# EAGLE design ft232-modul_v1.0 (EAGLE 4.14)
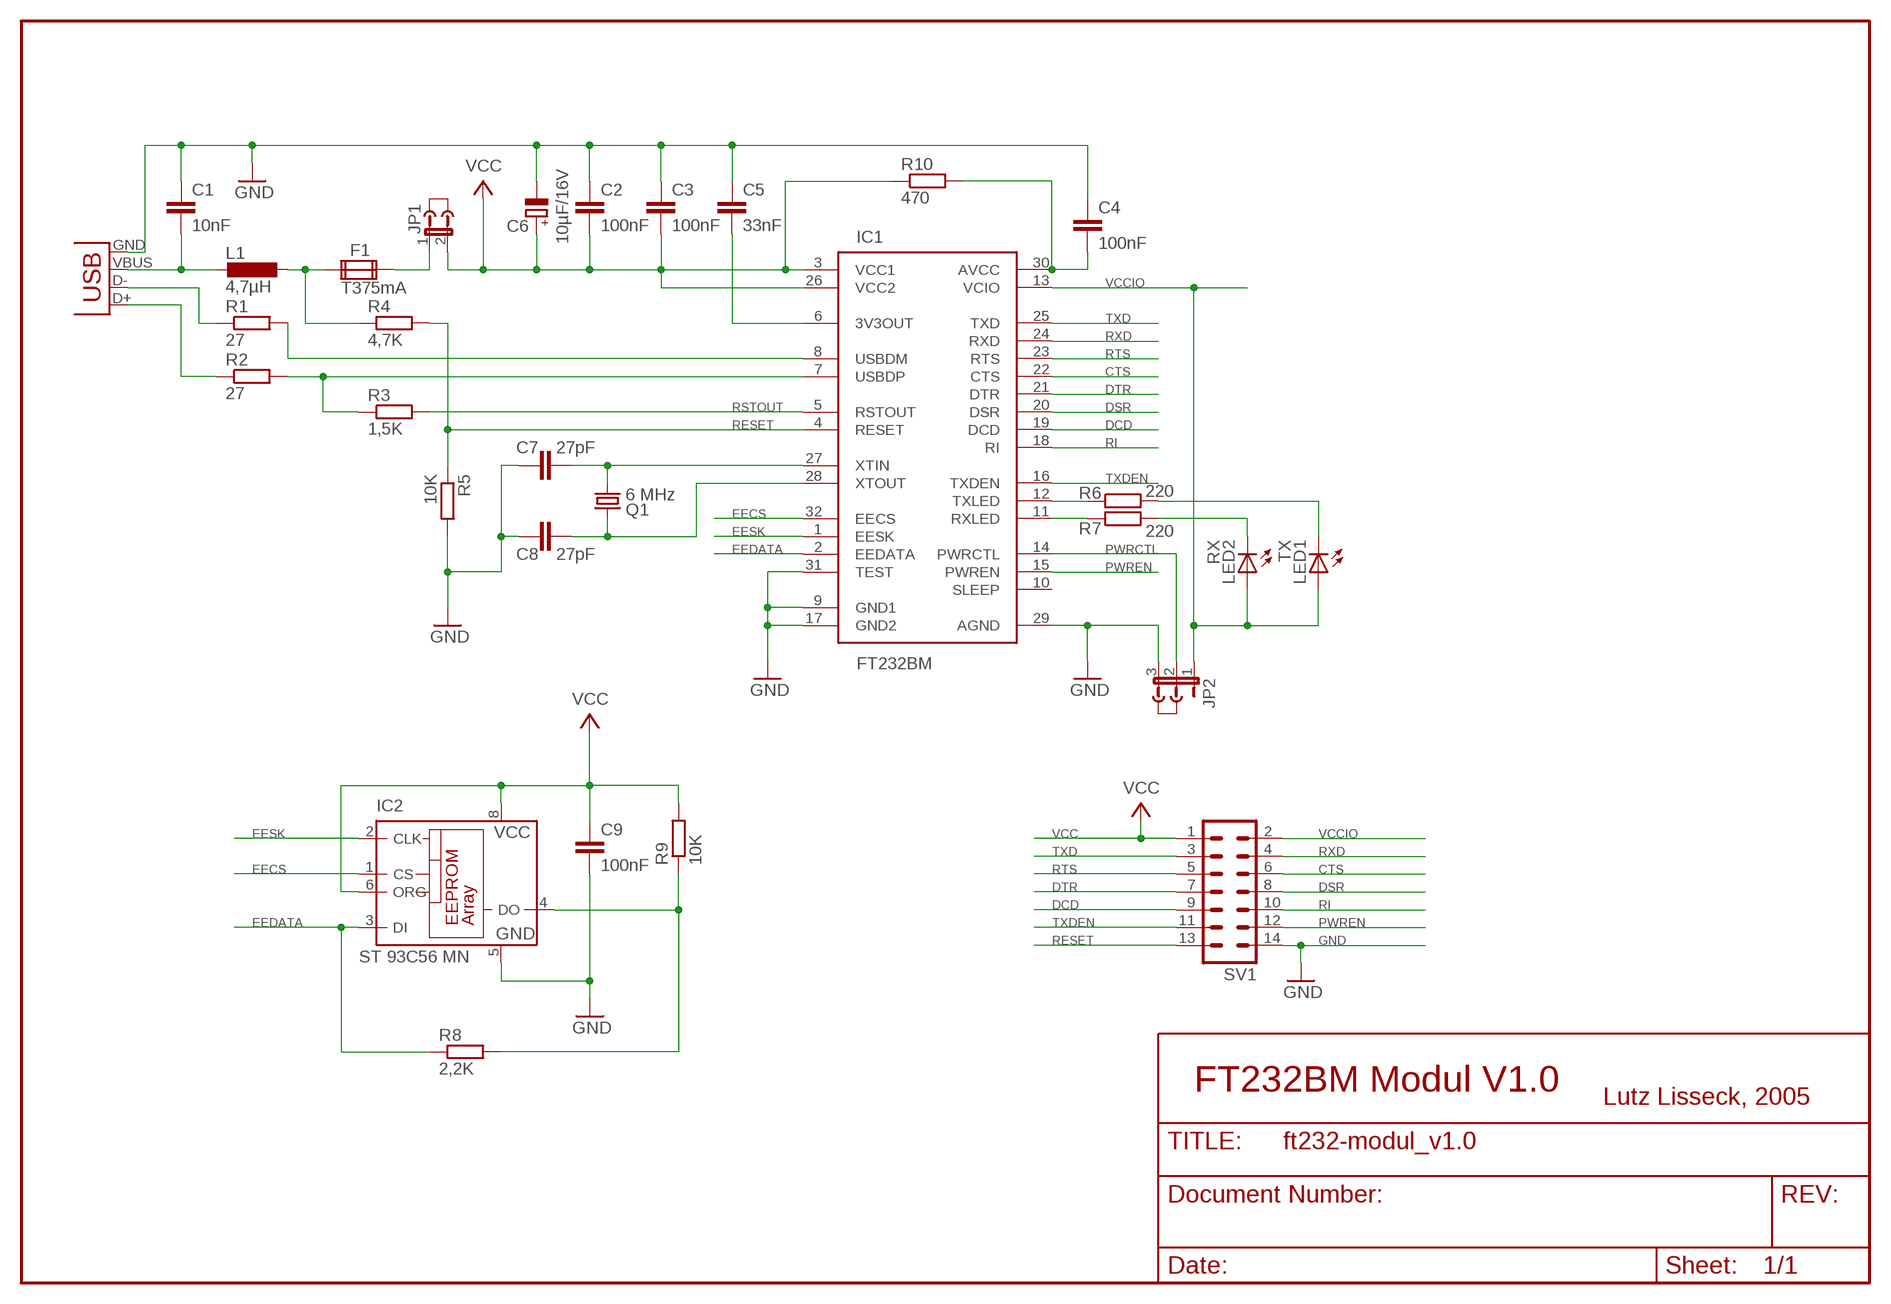
[diagram p0: schematic, sheet 1]

## Parts
C1  10nF  C-EUC0805K  [C0805K]
C2  100nF  C-EUC0805K  [C0805K]
C3  100nF  C-EUC0805K  [C0805K]
C4  100nF  C-EUC0805K  [C0805K]
C5  33nF  C-EUC0805K  [C0805K]
C6  10µF/16V  CPOL-EUCT3528  [CT3528]
C7  27pF  C-EUC0805K  [C0805K]
C8  27pF  C-EUC0805K  [C0805K]
C9  100nF  C-EUC0805K  [C0805K]
F1  T375mA  SMD-FUSE  [SMD-FUSE]
IC1  FT232BM  [QFP-32]
IC2  ST 93C56 MN  93LC46SN  [SO-08]
J1  JUMPER  [JUMP]
J2  JUMPER  [JUMP]
JP1  JP1E  [JP1]
JP2  JP2E  [JP2]
L1  4,7µH  L-EUL3230M  [L3230M]
LED1  TX  LED3MM  [LED3MM]
LED2  RX  LED3MM  [LED3MM]
Q1  6 MHz  CRYTALHC49S  [HC49/S]
R1  27  R-EU_R0805  [R0805]
R2  27  R-EU_R0805  [R0805]
R3  1,5K  R-EU_R0805  [R0805]
R4  4,7K  R-EU_R0805  [R0805]
R5  10K  R-EU_R0805  [R0805]
R6  220  R-EU_R0805  [R0805]
R7  220  R-EU_R0805  [R0805]
R8  2,2K  R-EU_R0805  [R0805]
R9  10K  R-EU_R0805  [R0805]
R10  470  R-EU_R0805  [R0805]
SV1  ML14  [ML14]
X1  USB-B-H  [USB-B-H]

## Nets
CTS: IC1.22(CTS) SV1.6
DCD: IC1.19(DCD) SV1.9
DSR: IC1.20(DSR) SV1.8
DTR: IC1.21(DTR) SV1.7
EECS: IC1.32(EECS) IC2.1(CS)
EEDATA: IC1.2(EEDATA) IC2.3(DI) R8.1
EESK: IC1.1(EESK) IC2.2(CLK)
GND: C1.1 C2.1 C3.1 C4.1 C5.1 C6.- C7.1 C8.2 C9.2 IC1.9(GND1) IC1.17(GND2) IC1.29(AGND) IC1.31(TEST) IC2.5(GND) JP2.3 R5.2 SV1.14 X1.GND
N$1: C1.2 L1.2 X1.VBUS
N$2: F1.1 L1.1 R4.1
N$3: F1.2 JP1.1
N$4: R1.1 X1.D-
N$5: R2.1 X1.D+
N$6: IC1.7(USBDP) R2.2 R3.1
N$7: C4.2 IC1.30(AVCC) R10.2
N$9: IC1.8(USBDM) R1.2
N$11: C5.2 IC1.6(3V3OUT)
N$14: IC1.11(RXLED) R7.1
N$15: IC1.12(TXLED) R6.1
N$16: C8.1 IC1.28(XTOUT) Q1.1
N$17: C7.2 IC1.27(XTIN) Q1.2
N$19: LED1.K(C) R6.2
N$20: LED2.K(C) R7.2
N$23: IC2.4(DO) R8.2 R9.1
PWRCTL: IC1.14(PWRCTL) JP2.2
PWREN: IC1.15(PWREN) SV1.12
RESET: IC1.4(RESET) R4.2 R5.1 SV1.13
RI: IC1.18(RI) SV1.10
RSTOUT: IC1.5(RSTOUT) R3.2
RTS: IC1.23(RTS) SV1.5
RXD: IC1.24(RXD) SV1.4
TXD: IC1.25(TXD) SV1.3
TXDEN: IC1.16(TXDEN) SV1.11
VCC: C2.2 C3.2 C6.+ C9.1 IC1.3(VCC1) IC1.26(VCC2) IC2.6(ORG) IC2.8(VCC) JP1.2 R9.2 R10.1 SV1.1
VCCIO: IC1.13(VCIO) JP2.1 LED1.A LED2.A SV1.2
Unconnected: IC1.10(SLEEP) IC2.7(NU)

## Notes on the sheet
- FT232BM Modul V1.0
- Lutz Lisseck, 2005

## Library data of the parts
C1-C5 C7-C9 = rcl:C-EU: CAPACITOR, European symbol
C6 = rcl:CPOL-EU: POLARIZED CAPACITOR, European symbol
F1 = mmc_mp3:SMD-FUSE: SMD-FUSE
IC1 = FTDI-ftdi:FT232BM: FT232BM USB-RS232 Wandler FTDI
IC2 = microchip:93*: Serial EPROM 1 K/2 K/4 K, low voltage, Microwire
J1 J2 = jumper:JUMPER: JUMPER header
JP1 = jumper:JP1E: JUMPER
JP2 = jumper:JP2E: JUMPER
L1 = rcl:L-EU: INDUCTOR, European symbol
LED1 LED2 = led:LED: LED OSRAM: - CHIPLED LG R971, LG N971, LY N971, LG Q971, LY Q971, LO R971, LY R971 LH N974, LH R974 LS Q976, LO Q976, LY Q976 LO Q996 - Hyper CHIPLED LW Q18S LB Q993, LB Q99A, LB R99A - SideLED LS A670, LO A670, LY A670, LG A670, LP A670 LB A673, LV A673, LT A673, LW A673 LH A674 LY A675 LS A676, LA A676, LO A676, LY A676, LW A676 LS A679, LY A679, LG A679 - Hyper Micro SIDELED® LS Y876, LA Y876, LO Y876, LY Y876 LT Y87S - SmartLED LW L88C, LW L88S LB L89C, LB L89S, LG L890 LS L89K, LO L89K, LY L89K LS L896, LA L896, LO L896, LY L896 - TOPLED LS T670, LO T670, LY T670, LG T670, LP T670 LSG T670, LSP T670, LSY T670, LOP T670, LYG T670 LG T671, LOG T671, LSG T671 LB T673, LV T673, LT T673, LW T673 LH T674 LS T676, LA T676, LO T676, LY T676, LB T676, LH T676, LSB T676, LW T676 LB T67C, LV T67C, LT T67C, LS T67K, LO T67K, LY T67K, LW E67C LS E67B, LA E67B, LO E67B, LY E67B, LB E67C, LV E67C, LT E67C LW T67C LS T679, LY T679, LG T679 LS T770, LO T770, LY T770, LG T770, LP T770 LB T773, LV T773, LT T773, LW T773 LH T774 LS E675, LA E675, LY E675, LS T675 LS T776, LA T776, LO T776, LY T776, LB T776 LHGB T686 LT T68C, LB T68C - Hyper Mini TOPLED® LB M676 - Mini TOPLED Santana® LG M470 LS M47K, LO M47K, LY M47K Source: http://www.osram.convergy.de/
Q1 = crystal:CRYTAL: CRYSTAL
R1-R10 = rcl:R-EU_: RESISTOR, European symbol
SV1 = con-harting-ml:ML14: HARTING
X1 = con-usb:USB: USB Connectors

## Board
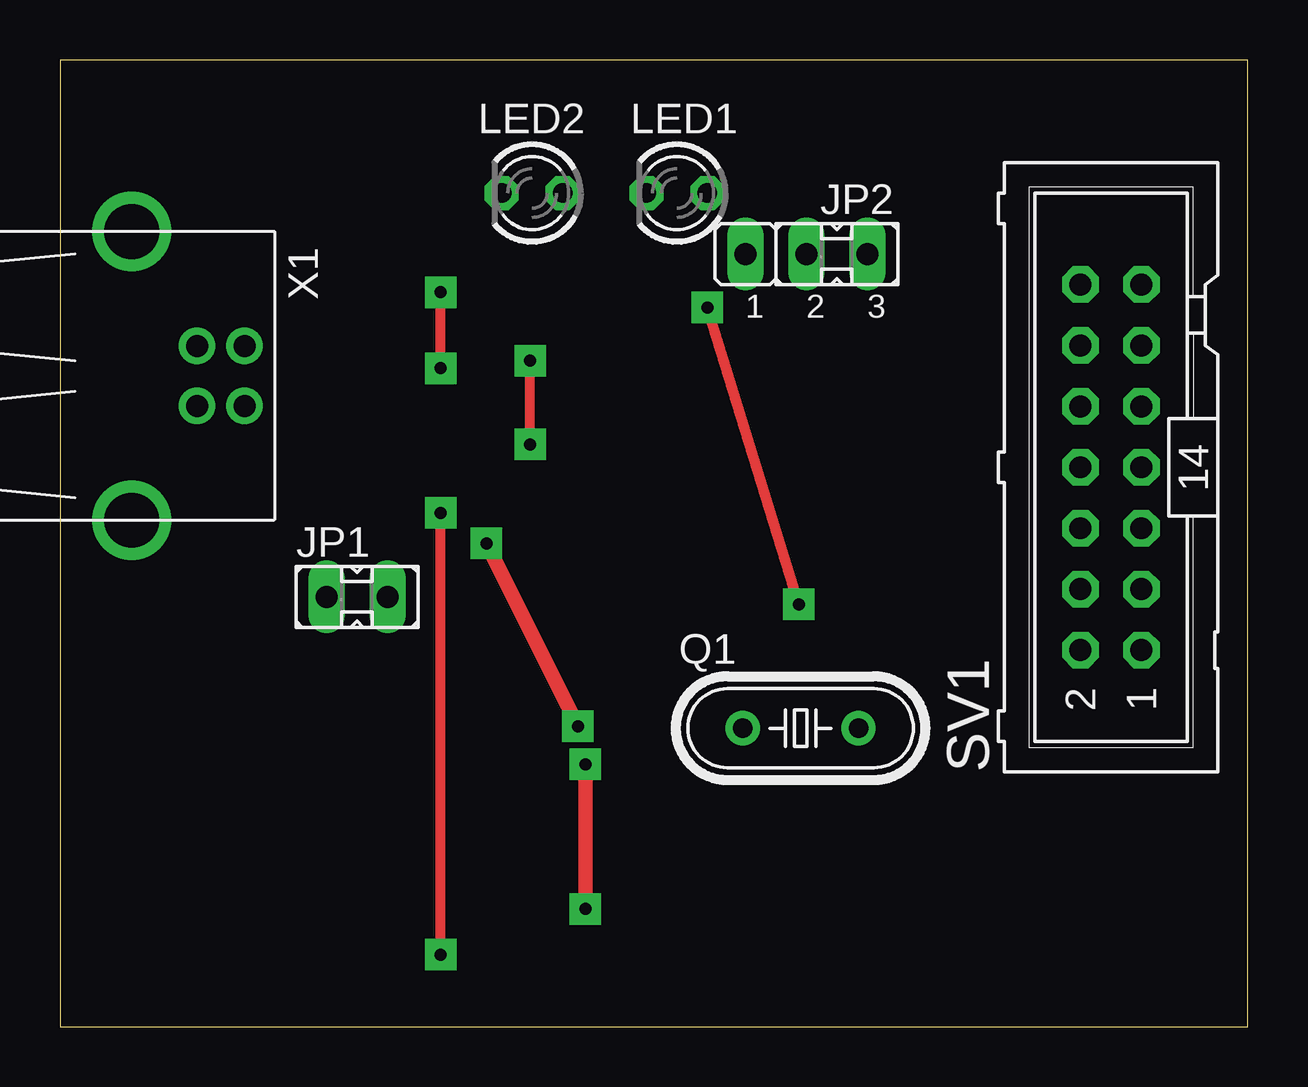
[diagram p1: board, top side]
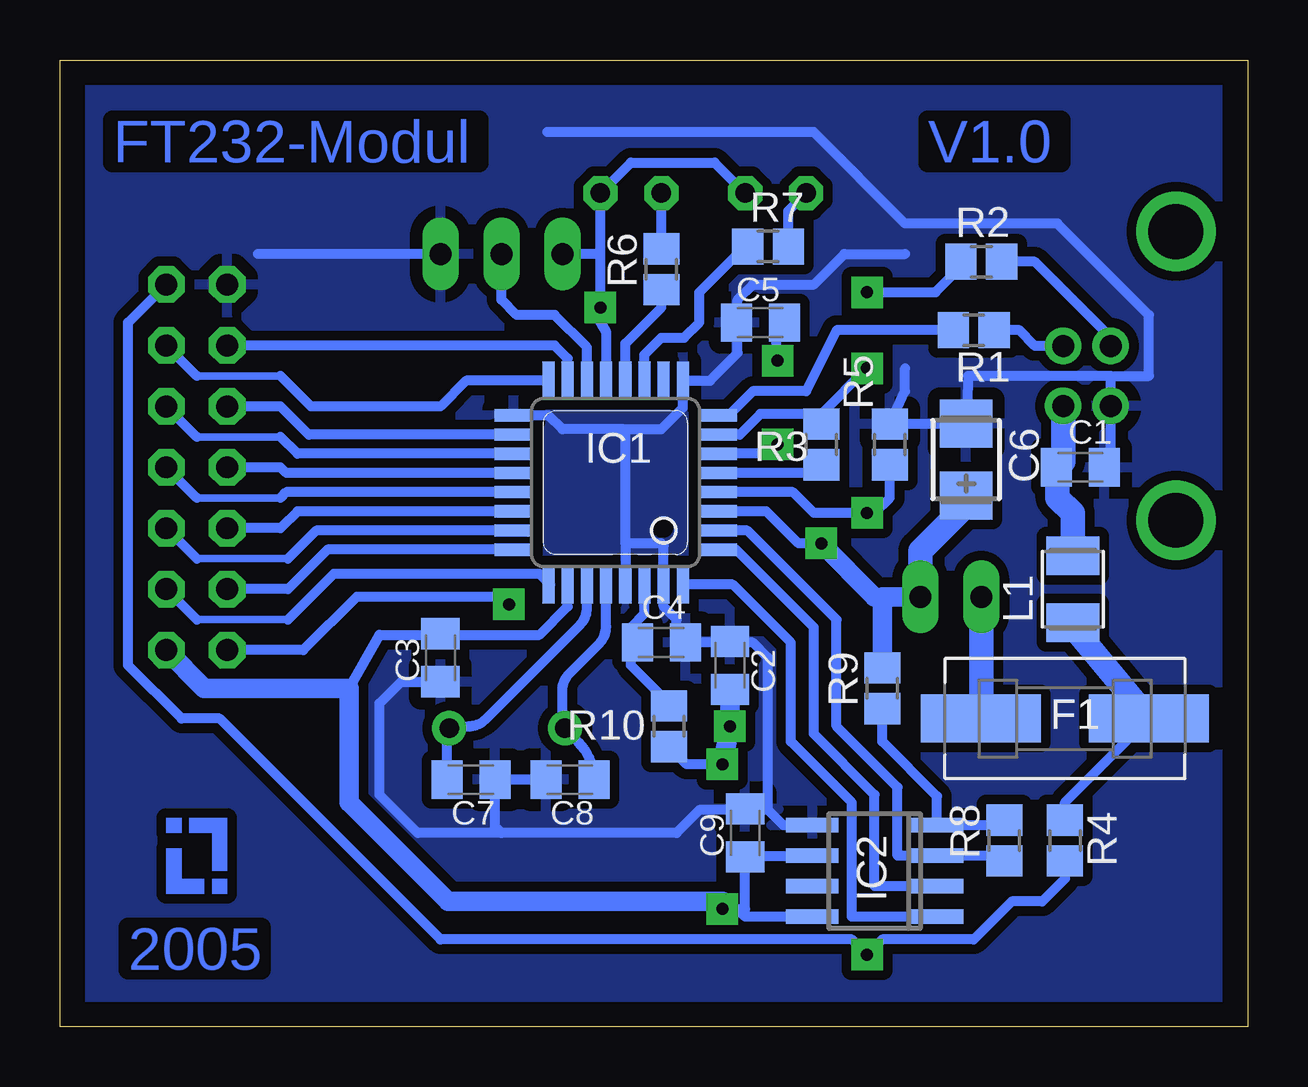
[diagram p2: board, bottom side, seen from below]

Size 49.51 x 40.31 mm. Coordinates in mm from the lower left corner, seen from the top.
Outline: 0,0 49.51,0 49.51,40.31 0,40.31 0,0
Copper layers (1*16): Top 0.035mm / dielectric 1.5mm / Bottom 0.035mm
Design rules "default": minimum track width 10mil, minimum drill 0.5mm, track to track 10mil, track to pad 10mil, pad to pad 10mil, via to via 10mil, smd to smd 6mil, copper to edge 40mil, drill to drill 8mil, minimum pad ring 12mil, minimum via ring 16mil, stop-mask expansion 4mil, vias tented up to drill 0mil, thermal gap 20mil
bRestrict: area 24.4,20.8 to 24.4,20.9

### Footprints (pad centres in the part's own frame; a part is rotated, then mirrored left to right if it is on the bottom)
C0805K = smd 1.3 x 1.6: 1 -1,0; 2 1,0
CT3528 = smd 2 x 2.2: + 1.5,0; - -1.5,0
SMD-FUSE = smd 5 x 2: 1 -3.5,0; 2 3.5,0
QFP-32 = smd 0.508 x 1.6: 1 -2.8,-4.25; 2 -2,-4.25; 3 -1.2,-4.25; 4 -0.4,-4.25; 5 0.4,-4.25; 6 1.2,-4.25; 7 2,-4.25; 8 2.8,-4.25; 17 2.8,4.25; 18 2,4.25; 19 1.2,4.25; 20 0.4,4.25; 21 -0.4,4.25; 22 -1.2,4.25; 23 -2,4.25; 24 -2.8,4.25 | smd 1.6 x 0.508: 9 4.25,-2.8; 10 4.25,-2; 11 4.25,-1.2; 12 4.25,-0.4; 13 4.25,0.4; 14 4.25,1.2; 15 4.25,2; 16 4.25,2.8; 25 -4.25,2.8; 26 -4.25,2; 27 -4.25,1.2; 28 -4.25,0.4; 29 -4.25,-0.4; 30 -4.25,-1.2; 31 -4.25,-2; 32 -4.25,-2.8
SO-08 = smd 0.6 x 2.2: 1 -1.905,-2.6; 2 -0.635,-2.6; 3 0.635,-2.6; 4 1.905,-2.6; 5 1.905,2.6; 6 0.635,2.6; 7 -0.635,2.6; 8 -1.905,2.6
JP1 = drill 0.914 long: 1 0,-1.27; 2 0,1.27
JP2 = drill 0.914 long: 1 -2.54,0; 2 0,0; 3 2.54,0
L3230M = smd 1.6 x 2.2: 1 -1.4,0; 2 1.4,0
LED3MM = drill 0.813 octagon: A -1.27,0; K 1.27,0
HC49/S = drill 0.813 round: 1 -2.413,0; 2 2.413,0
R0805 = smd 1.3 x 1.5: 1 -0.85,0; 2 0.85,0
ML14 = drill 0.914 octagon: 1 -7.62,-1.27; 2 -7.62,1.27; 3 -5.08,-1.27; 4 -5.08,1.27; 5 -2.54,-1.27; 6 -2.54,1.27; 7 0,-1.27; 8 0,1.27; 9 2.54,-1.27; 10 2.54,1.27; 11 5.08,-1.27; 12 5.08,1.27; 13 7.62,-1.27; 14 7.62,1.27
USB-B-H = drill 0.914 round: D+ 0,1.25; D- 1.981,1.25; GND 0,-1.25; VBUS 1.981,-1.25 | drill 2.286 round: P$1 -2.718,-6.02; P$2 -2.718,6.02

### Placement (x,y rotation side)
C1  6.98,23.33 180 bottom
C2  21.58,15.08 270 bottom
C3  33.65,15.39 90 bottom
C4  24.44,16.03 180 bottom
C5  20.31,29.36 0 bottom
C6  11.74,23.65 270 bottom
C7  32.38,10.31 180 bottom
C8  28.25,10.31 180 bottom
C9  20.95,8.09 90 bottom
F1  7.62,12.85 180 bottom
IC1  26.35,22.7 90 bottom
IC2  15.55,6.5 90 bottom
J1  12.38,17.93 90 top
J2  32.38,32.22 90 top
JP1  12.38,17.93 270 top
JP2  31.11,32.22 0 top
L1  7.3,18.25 90 bottom
LED1  25.71,34.76 180 top
LED2  19.68,34.76 180 top
Q1  30.87,12.46 0 top
R1  11.43,29.04 180 bottom
R2  11.11,31.9 180 bottom
R3  17.77,24.28 270 bottom
R4  7.62,7.77 270 bottom
R5  14.92,24.28 90 bottom
R6  24.44,31.58 90 bottom
R7  20,32.54 0 bottom
R8  10.16,7.77 90 bottom
R9  15.24,14.12 90 bottom
R10  24.12,12.54 90 bottom
SV1  43.81,23.33 90 top
X1  5.71,27.14 0 top

### Tracks (layer width: path | path; a pad name or v marks a point on that pad's centre or on a via)
CTS
  Bottom 0.406: IC1.22 39.61,21.49 40.32,20.79 SV1.6
DCD
  Bottom 0.305: 40.32,24.6 43.81,24.6
  Bottom 0.406: IC1.19 39.61,23.89 40.32,24.6 | 43.81,24.6 SV1.9
DSR
  Bottom 0.406: IC1.20 40.08,23.09 40.32,23.33 SV1.8
DTR
  Bottom 0.305: 40.32,22.06 43.81,22.06
  Bottom 0.406: IC1.21 40.08,22.29 40.32,22.06 | 43.81,22.06 SV1.7
EECS
  Bottom 0.406: IC2.1 16.5,4.6 16.5,9.36 19.04,11.9 19.04,16.03 21.46,18.45 IC1.32
EEDATA
  Bottom 0.406: IC1.2 20.86,20.7 17.14,16.98 17.14,12.54 14.6,10 14.6,7.14 IC2.3 10.47,7.14 10.16,6.82 R8.1
EESK
  Bottom 0.406: IC2.2 15.55,5.87 15.55,9.68 18.09,12.22 18.09,16.66 21.32,19.89 IC1.1
GND
  Bottom 0.406: 5.71,25.87 X1.GND | 5.71,27.14 11.66,27.14 C6.- 11.74,25.23 11.85,25.13 R5.2 14.28,26.5 14.28,27.46 | 5.71,25.87 5.71,27.14 | C1.1 6.03,23.33 5.71,23.65 5.71,25.87 | IC2.5 19.36,8.41 20,9.04 | 14.28,32.22 16.82,32.22 18.09,30.95 20.63,30.95 21.27,30.31 21.27,29.36 | 26.03,24.92 24.44,24.92 23.55,25.81 IC1.9 22.41,26.95 21.27,28.09 21.27,29.36 | 26.03,24.92 28.57,24.92 29.15,25.49 IC1.17 | 25.95,20.15 IC1.29 | 25.95,20.15 25.95,24.83 26.03,24.92 | 29.2,37.3 18.09,37.3 14.28,33.49 7.93,33.49 4.12,29.68 4.12,27.14 5.71,27.14 | 21.27,29.36 C5.1 | JP2.3 41.27,32.22 | 20,9.04 20.95,9.04 | 20,9.04 20,15.39 20.63,16.03 21.9,16.03 | 21.9,16.03 C2.1 | 21.9,16.03 C4.1 23.81,16.03 23.81,16.98 24.35,17.52 IC1.31 24.35,20.06 24.44,20.15 25.95,20.15 | 29.2,10.31 C8.2 C7.1 31.38,8.36 31.11,8.09 | 31.11,8.09 23.81,8.09 22.86,9.04 20.95,9.04 | 20.95,9.04 C9.2 | C3.1 35.29,14.39 36.19,13.49 36.19,9.68 34.6,8.09 31.11,8.09
  pour Bottom (isolate 0.406): 1.27,1.1 48.26,1.1 48.26,39.2 1.27,39.2
N$1
  Bottom 0.406: 7.69,23.57 7.93,23.33 C1.2
  Bottom 1.016: 7.69,23.57 X1.VBUS | L1.2 7.3,21.42 7.93,22.06 7.93,23.33
N$2
  Bottom 0.406: 7.3,16.98 L1.1 7.3,16.67 | F1.1 7.62,9.36 R4.1
  Bottom 1.016: F1.1 7.3,16.67
N$3
  Bottom 0.406: F1.2 11.11,13.48
  Bottom 1.016: 11.11,13.48 JP1.1
N$4
  Bottom 0.406: X1.D- 8.87,28.39 9.52,29.04 R1.1
N$5
  Bottom 0.406: X1.D+ 5.71,28.73 8.89,31.9 R2.1
N$6  (via drill 0.5)
  Top 0.406: v15.87,27.46 v15.87,30.63
  Bottom 0.406: IC1.7 21.17,24.7 20.31,25.55 17.46,25.55 R3.1 17.77,25.55 v15.87,27.46 | R2.2 11.96,31.69 13.01,30.63 v15.87,30.63
N$7
  Bottom 0.406: R10.2 24.12,13.49 25.71,15.08 25.71,16.03 | IC1.30 25.15,17.23 25.71,16.66 25.71,16.03 | 25.71,16.03 C4.2
N$9
  Bottom 0.406: IC1.8 21.64,25.49 20.63,26.5 18.41,26.5 17.14,29.04 R1.2
N$11  (via drill 0.5)
  Top 0.406: v19.6,24.28 v19.6,27.77
  Bottom 0.406: IC1.6 20.07,23.89 v19.6,24.28 | C5.2 19.36,29.36 19.68,29.04 v19.6,27.77
N$14
  Bottom 0.406: IC1.11 25.15,28.02 24.44,28.73 23.49,28.73 22.86,29.36 22.86,30.63 20.95,32.54 R7.1
N$15
  Bottom 0.406: IC1.12 25.95,28.49 24.44,30 R6.1
N$16
  Bottom 0.406: IC1.28 26.75,16.68 arc45 27.04,15.97 28.28,14.73 arc-45 28.57,14.03 28.57,12.54 | 28.57,12.54 arc45 28.52,12.51 Q1.1 arc45 28.51,12.48 28.57,12.54 | C8.1 arc-45 27.89,11.86 28.57,12.54
N$17
  Bottom 0.406: IC1.27 27.55,17.46 arc45 27.84,16.76 31.77,12.83 arc45 32.48,12.54 33.33,12.54 | 33.33,12.54 arc-45 33.31,12.48 Q1.2 arc-45 33.31,12.51 33.33,12.54 | C7.2 33.38,12.42 arc45 33.33,12.54
N$19
  Bottom 0.406: R6.2 LED1.K
N$20
  Bottom 0.406: R7.2 19.15,34.02 LED2.K
N$23
  Bottom 0.406: R9.1 15.24,11.9 12.95,9.62 IC2.4 10.47,8.41 10.16,8.73 R8.2
PWRCTL
  Bottom 0.406: IC1.14 27.55,28.34 28.89,29.68 30.47,29.68 31.11,30.31 JP2.2
PWREN
  Bottom 0.406: IC1.15 28.35,27.87 28.89,28.41 SV1.12
RESET  (via drill 0.5)
  Top 0.406: v15.87,3.01 v15.87,21.42
  Bottom 0.406: SV1.13 46.67,29.36 46.67,15.08 44.45,12.85 42.86,12.85 33.65,3.64 16.5,3.64 v15.87,3.01 15.24,3.64 11.43,3.64 9.84,5.23 8.57,5.23 7.62,6.18 R4.2 | IC1.4 18.96,22.29 18.09,21.42 v15.87,21.42 15.55,21.42 14.92,22.06 R5.1
RI
  Bottom 0.406: IC1.18 39.14,24.7 40.32,25.87 SV1.10
RSTOUT
  Bottom 0.406: R3.2 17.77,23.33 18.01,23.09 IC1.5
RTS
  Bottom 0.305: 40,19.52 43.81,19.52
  Bottom 0.406: IC1.23 38.83,20.7 40,19.52 | 43.81,19.52 SV1.5
RXD
  Bottom 0.406: IC1.24 38.36,19.89 40,18.25 SV1.4
TXD
  Bottom 0.305: 40,16.98 43.81,16.98
  Bottom 0.406: IC1.25 29.08,18.45 29.52,18.88 38.1,18.88 40,16.98 | 43.81,16.98 SV1.3
TXDEN
  Bottom 0.305: 40.32,27.14 43.81,27.14
  Bottom 0.406: IC1.16 32.58,26.95 33.65,25.87 39.05,25.87 40.32,27.14 | 43.81,27.14 SV1.11
VCC  (via drill 0.5)
  Top 0.61: v21.58,12.54 v17.77,20.15 | v21.9,4.92 v21.9,10.95
  Bottom 0.406: C9.1 20.63,7.14 IC2.6 | C9.1 20.95,7.14 | 11.74,21.74 C6.+ | IC1.3 20.07,21.49 18.73,20.15 v17.77,20.15 | 15.55,17.93 15.24,17.93 | IC1.26 28.35,17.52 29.52,16.34 33.65,16.34 | 37.46,14.12 36.19,16.34 33.65,16.34 | R10.1 23.39,10.95 v21.9,10.95 | v21.9,4.92 21.9,5.23 | 33.65,16.34 C3.2 | IC2.8 20.95,4.6 21.27,4.92 v21.9,4.92 | C9.1 20.95,4.92 v21.9,4.92
  Bottom 0.813: R9.2 15.24,17.93 JP1.2 | SV1.1 43.49,14.12 37.46,14.12 37.46,9.36 33.33,5.23 21.9,5.23 | C2.2 v21.58,12.54 v21.9,10.95 | v17.77,20.15 15.55,17.93
  Bottom 1.016: 11.74,21.74 13.65,19.84 JP1.2
VCCIO  (via drill 0.5)
  Top 0.406: v30.79,17.61 v26.98,30
  Bottom 0.406: LED2.A 22.22,36.03 25.71,36.03 LED1.A 26.98,32.22 | SV1.2 39.37,15.71 37.14,17.93 31.11,17.93 v30.79,17.61 | 26.98,32.22 v26.98,30 26.98,29.36 26.74,28.97 IC1.13 | 26.98,32.22 JP2.1
(copper drawn outside any net)
  shapes: Bottom area x6

### Text on the board
Bottom: V1.0 | FT232-Modul | 2005